# Altium schematic sheet D_GND.SchDoc
size A4; SheetNumber: 20; SheetTotal: 31
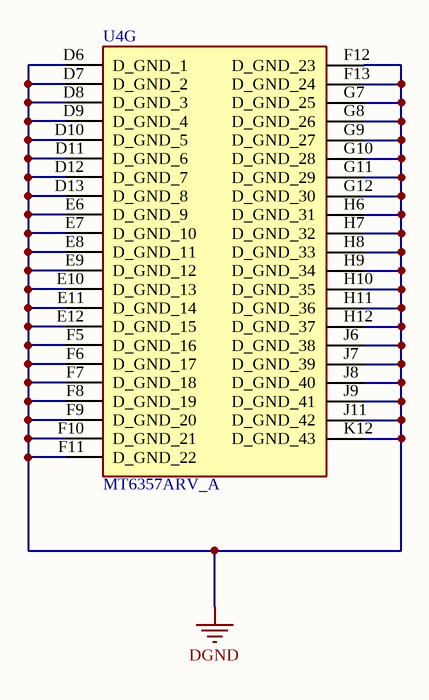
[diagram p0: D_GND.SchDoc]

## Parts
U4  MT6357ARV_A  [BGA209C40P17X16_700X660X100]  (part G of 7)

## Nets
DGND: U4.D6(D_GND_1) U4.D7(D_GND_2) U4.D8(D_GND_3) U4.D9(D_GND_4) U4.D10(D_GND_5) U4.D11(D_GND_6) U4.D12(D_GND_7) U4.D13(D_GND_8) U4.E6(D_GND_9) U4.E7(D_GND_10) U4.E8(D_GND_11) U4.E9(D_GND_12) U4.E10(D_GND_13) U4.E11(D_GND_14) U4.E12(D_GND_15) U4.F5(D_GND_16) U4.F6(D_GND_17) U4.F7(D_GND_18) U4.F8(D_GND_19) U4.F9(D_GND_20) U4.F10(D_GND_21) U4.F11(D_GND_22) U4.F12(D_GND_23) U4.F13(D_GND_24) U4.G7(D_GND_25) U4.G8(D_GND_26) U4.G9(D_GND_27) U4.G10(D_GND_28) U4.G11(D_GND_29) U4.G12(D_GND_30) U4.H6(D_GND_31) U4.H7(D_GND_32) U4.H8(D_GND_33) U4.H9(D_GND_34) U4.H10(D_GND_35) U4.H11(D_GND_36) U4.H12(D_GND_37) U4.J6(D_GND_38) U4.J7(D_GND_39) U4.J8(D_GND_40) U4.J9(D_GND_41) U4.J11(D_GND_42) U4.K12(D_GND_43)

## Library data of the parts
U4 = MT6357ARV_A: Integrated Circuit; Manufacturer_Name: Mediatek; Manufacturer_Part_Number: MT6357ARV/A; Datasheet Link: https://mediatek-marketing.files.svdcdn.com/production/documents/Genio-PMICs/MTK_MT6357_Product-Brief_v1.0.pdf?dm=1696608680; Height: 1mm; Mouser Part Number: 840-MT6357ARV/A; Mouser Price/Stock: https://www.mouser.co.uk/ProductDetail/MediaTek/MT6357ARV-A?qs=Jm2GQyTW%2Fbim3iWdQ0ZJPw%3D%3D